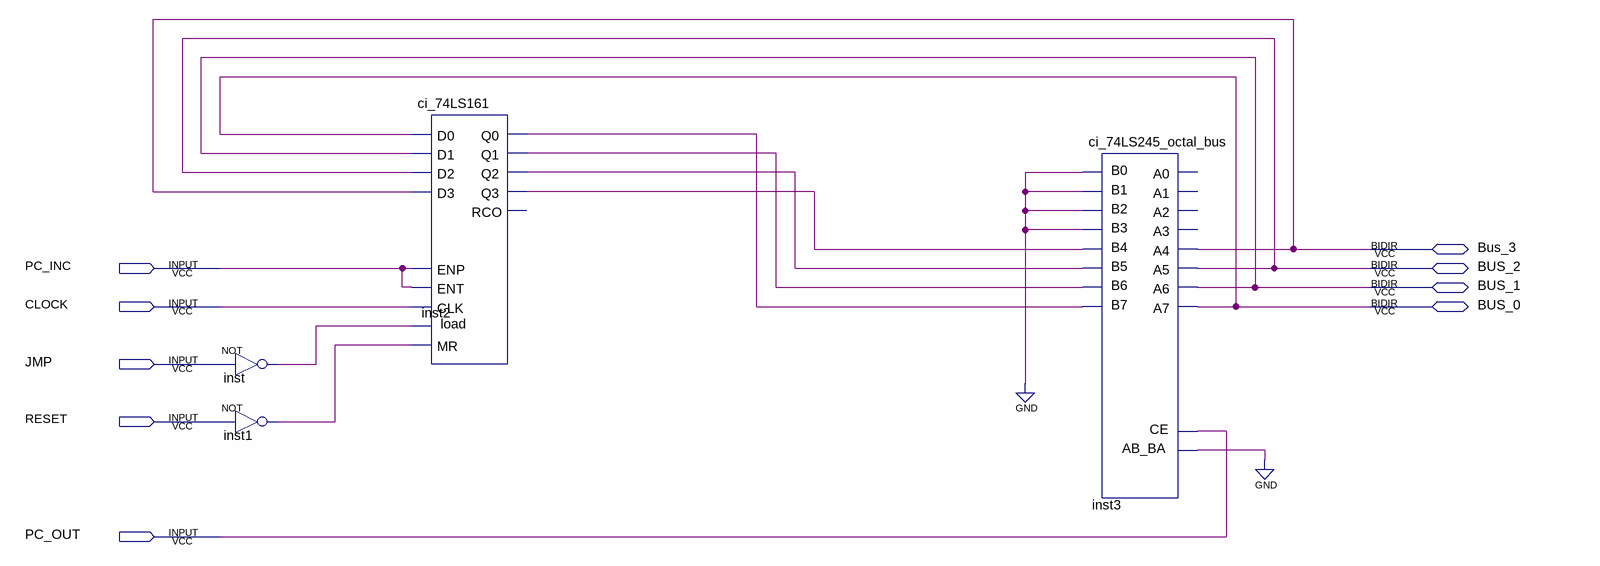
[diagram p0: schematic sheet]
// Quartus schematic cp_program_counter.bdf as structural Verilog: 4 symbols, 9 pins
module cp_program_counter (
  input  PC_INC,
  input  CLOCK,
  input  JMP,
  input  RESET,
  input  PC_OUT,
  inout  Bus_3,
  inout  BUS_2,
  inout  BUS_1,
  inout  BUS_0
);

  wire inst1_out, inst2_q0, inst2_q1, inst2_q2, inst2_q3, inst3_b0, inst_out;

  not inst (inst_out, JMP);
  not inst1 (inst1_out, RESET);
  ci_74LS161 inst2 (
    .D3(Bus_3), .D2(BUS_2), .load(inst_out), .CLK(CLOCK), .D0(BUS_0), .MR(inst1_out), .D1(BUS_1),
    .ENP(PC_INC), .ENT(PC_INC), .Q2(inst2_q2), .Q3(inst2_q3), .Q1(inst2_q1), .Q0(inst2_q0));  // open: RCO
  ci_74LS245_octal_bus inst3 (
    .CE(PC_OUT), .AB_BA(1'b0), .B6(inst2_q1), .B7(inst2_q0), .B0(inst3_b0), .B1(inst3_b0), .B2(inst3_b0),
    .B3(inst3_b0), .B4(inst2_q3), .B5(inst2_q2), .A4(Bus_3), .A5(BUS_2), .A6(BUS_1), .A7(BUS_0));  // open: A0, A1, A2, A3
  // also tied to GND on the sheet: inst3_b0
endmodule
